# Altium schematic sheet GoodUSB_Sheet.SchDoc
size A4
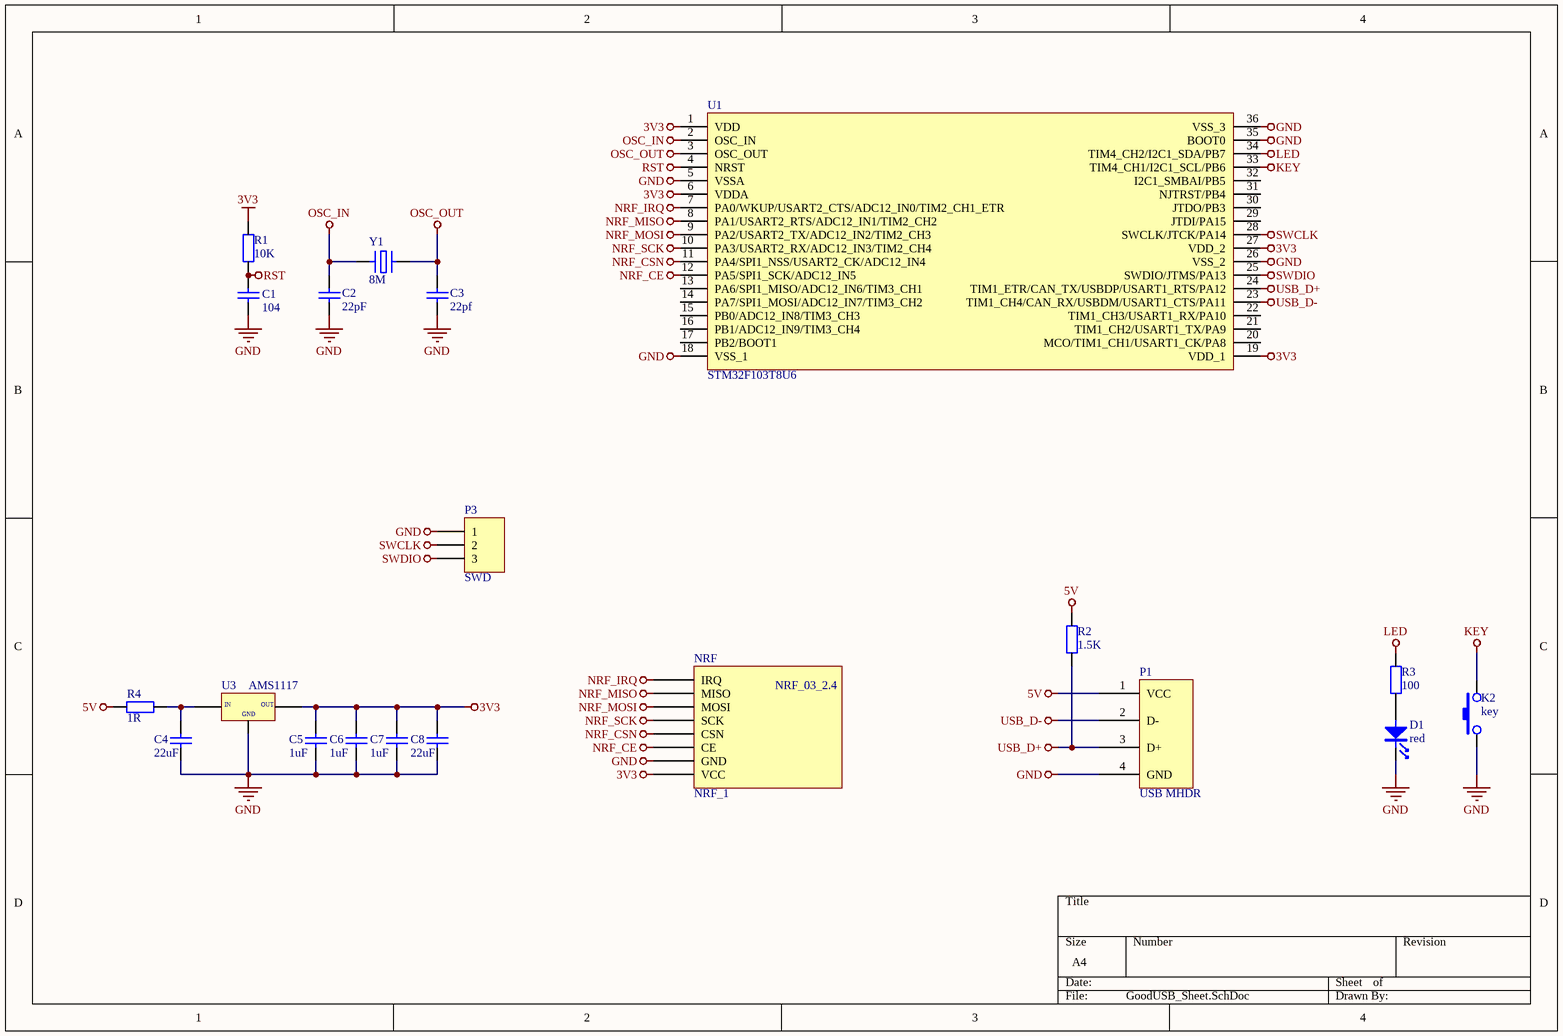
[diagram p0: GoodUSB_Sheet.SchDoc]

## Parts
C1  104  [电容_C0603]
C2  22pF  [电容_C0603]
C3  22pf  [电容_C0603]
C4  22uF  [电容_C1206]
C5  1uF  [电容_C0603]
C6  1uF  [电容_C0603]
C7  1uF  [电容_C0603]
C8  22uF  [电容_C1206]
D1  red  [LED_0603]
K2  key  [开关按键_SKTH]
NRF  NRF_1  [NRF-1]
P1  USB MHDR  [接插件_USB 公头 90°]
P3  SWD  [HDR1X3]
R1  10K  [电阻_R0603]
R2  1.5K  [电阻_R0603]
R3  100  [电阻_R0603]
R4  1R  [电阻_R0603]
U1  STM32F103T8U6  [ST主控_VFQFPN36]
U3  AMS1117  [稳压芯片_SOT-89]
Y1  F: 8M  [晶振_5032]  (hidden comment: XTAL)

## Nets
3V3: C5.2 C6.2 C7.2 C8.2 NRF.1(VCC) R1.2 U1.1(VDD) U1.6(VDDA) U1.19(VDD_1) U1.27(VDD_2) U3.2(OUT)
5V: P1.1(VCC) R2.1 R4.2
GND: C1.1 C2.2 C3.2 C4.1 C5.1 C6.1 C7.1 C8.1 D1.K K2.1 NRF.2(GND) P1.0(GND) P1.4(GND) P3.1 U1.5(VSSA) U1.18(VSS_1) U1.26(VSS_2) U1.35(BOOT0) U1.36(VSS_3) U3.1(GND)
KEY: K2.2 U1.33(TIM4_CH1/I2C1_SCL/PB6)
LED: R3.1 U1.34(TIM4_CH2/I2C1_SDA/PB7)
NRF_CE: NRF.3(CE) U1.12(PA5/SPI1_SCK/ADC12_IN5)
NRF_CSN: NRF.4(CSN) U1.11(PA4/SPI1_NSS/USART2_CK/ADC12_IN4)
NRF_IRQ: NRF.8(IRQ) U1.7(PA0/WKUP/USART2_CTS/ADC12_IN0/TIM2_CH1_ETR)
NRF_MISO: NRF.7(MISO) U1.8(PA1/USART2_RTS/ADC12_IN1/TIM2_CH2)
NRF_MOSI: NRF.6(MOSI) U1.9(PA2/USART2_TX/ADC12_IN2/TIM2_CH3)
NRF_SCK: NRF.5(SCK) U1.10(PA3/USART2_RX/ADC12_IN3/TIM2_CH4)
OSC_IN: C2.1 U1.2(OSC_IN) Y1.1
OSC_OUT: C3.1 U1.3(OSC_OUT) Y1.2
RST: C1.2 R1.1 U1.4(NRST)
SWCLK: P3.2 U1.28(SWCLK/JTCK/PA14)
SWDIO: P3.3 U1.25(SWDIO/JTMS/PA13)
USB_D+: P1.3(D+) R2.2 U1.24(TIM1_ETR/CAN_TX/USBDP/USART1_RTS/PA12)
USB_D-: P1.2(D-) U1.23(TIM1_CH4/CAN_RX/USBDM/USART1_CTS/PA11)
NetC4_2: C4.2 R4.1 U3.3(VIN)
NetD1_A: D1.A R3.2

Not connected (* = marked no-connect by the designer): U1 13(PA6/SPI1_MISO/ADC12_IN6/TIM3_CH1) 14(PA7/SPI1_MOSI/ADC12_IN7/TIM3_CH2) 15(PB0/ADC12_IN8/TIM3_CH3) 16(PB1/ADC12_IN9/TIM3_CH4) 17(PB2/BOOT1) 20(MCO/TIM1_CH1/USART1_CK/PA8) 21(TIM1_CH2/USART1_TX/PA9) 22(TIM1_CH3/USART1_RX/PA10) 29(JTDI/PA15) 30(JTDO/PB3) 31(NJTRST/PB4) 32(I2C1_SMBAI/PB5)

## Notes on the sheet
- (in symbol AMS1117) IN
- (in symbol NRF_1) NRF_03_2.4

## Library data of the parts
C1-C8 = cap: U: 50V; 参数: Cap,0805,X7R,104K,50V,125C,±10%
  C1: C: 104
  C2: C: 22pF
  C3: C: 22pf
  C4 C8: C: 22uF
  C5-C7: C: 1uF
D1 = LED: 参数: LED,0603,Red
K2 = SW-PB: 参数: Key,TS-018A 2*4全包无柱带支架 力度250N; 备注: ADD
P3 = Header 3: Header, 3-Pin; LatestRevisionDate: 17-Jul-2002; LatestRevisionNote: Re-released for DXP Platform.; Publisher: Altium Limited
R1-R4 = Res: P: 1/8W; 参数: Res,0805,0R,±1%,1/8W,100ppm,155C
  R1: R: 10K
  R2: R: 1.5K
  R3: R: 100
  R4: R: 1R